# Altium schematic sheet Power.SchDoc
size A4; SheetNumber: 5; SheetTotal: 7
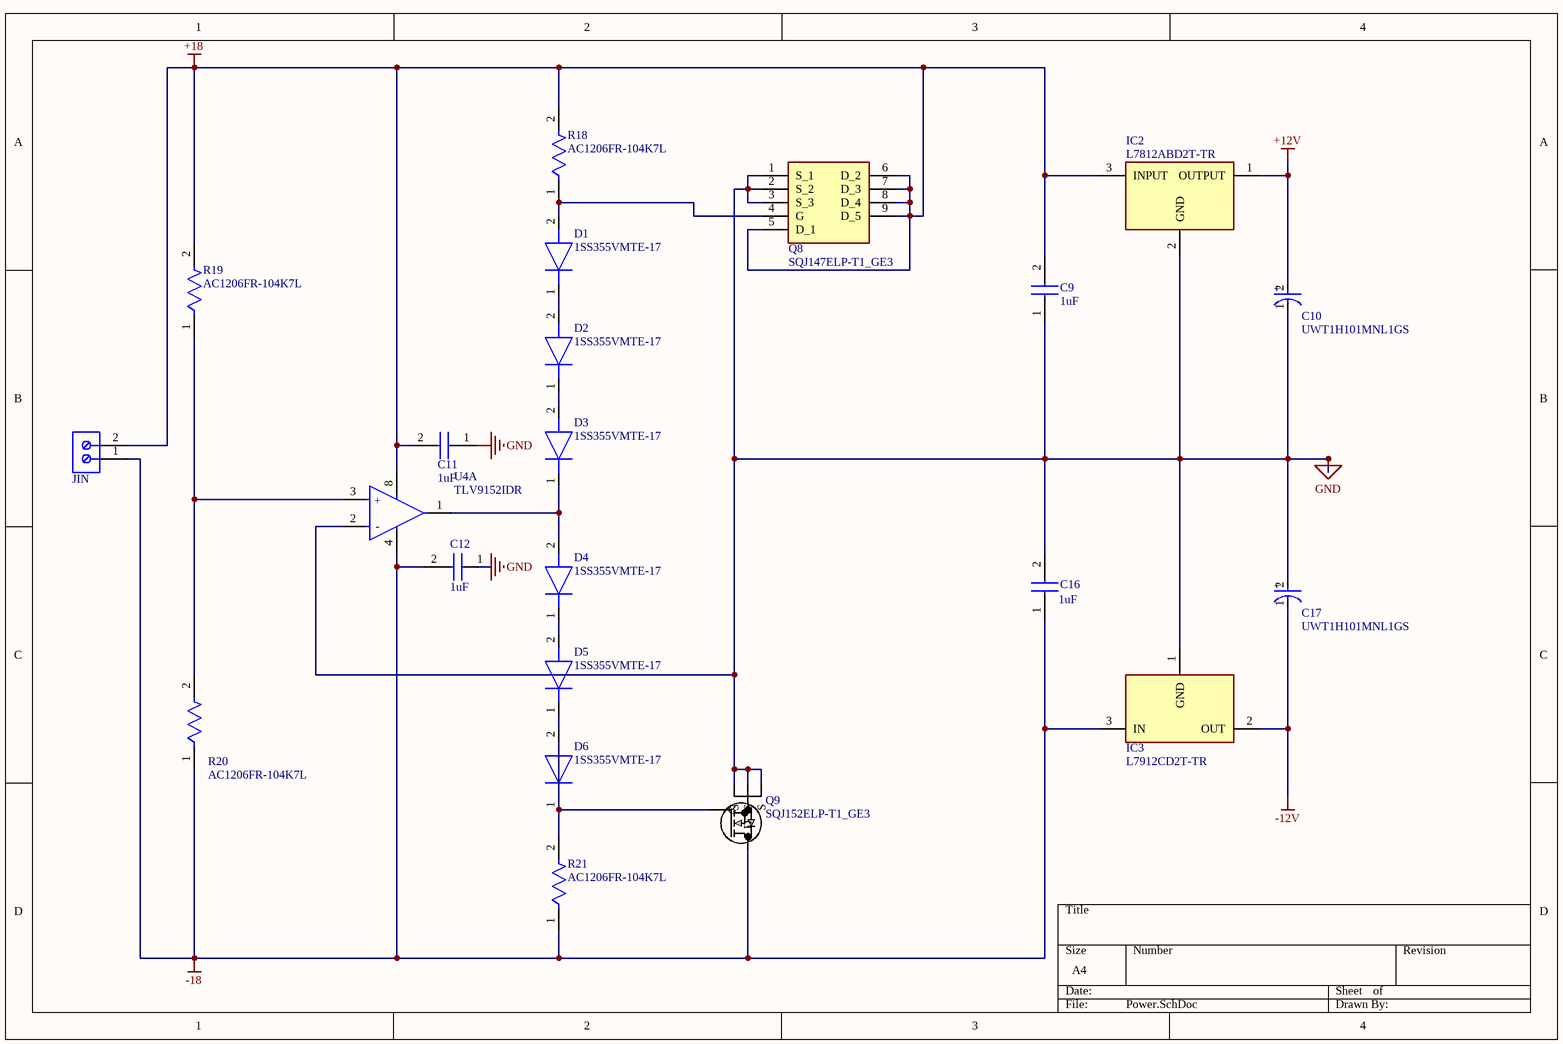
[diagram p0: Power.SchDoc]

## Parts
C9  1uF  [CAPC3216X178N]
C10  UWT1H101MNL1GS  [FP-UWT1H101MNL1GS-MFG]
C11  1uF  [CAPC3216X178N]
C12  1uF  [CAPC3216X178N]
C16  1uF  [CAPC3216X178N]
C17  UWT1H101MNL1GS  [FP-UWT1H101MNL1GS-MFG]
D1  1SS355VMTE-17  [UDZVTE1722B]
D2  1SS355VMTE-17  [UDZVTE1722B]
D3  1SS355VMTE-17  [UDZVTE1722B]
D4  1SS355VMTE-17  [UDZVTE1722B]
D5  1SS355VMTE-17  [UDZVTE1722B]
D6  1SS355VMTE-17  [UDZVTE1722B]
IC2  L7812ABD2T-TR  [L7812ABD2TTR]
IC3  L7912CD2T-TR  [L7905CD2TTR]
JIN  1714955  [PHOE-1714955_V]  (value not drawn)
Q8  SQJ147ELP-T1_GE3  [SQJ147ELPT1_GE3]
Q9  SQJ152ELP-T1_GE3  [DPAK5_ELP-T1_GE3_VIS]
R18  AC1206FR-104K7L  [FP-AC1206-MFG]
R19  AC1206FR-104K7L  [FP-AC1206-MFG]
R20  AC1206FR-104K7L  [FP-AC1206-MFG]
R21  AC1206FR-104K7L  [FP-AC1206-MFG]
U4  TLV9152IDR  [FP-D0008A-IPC_A]  (part A of 2)

## Nets
+12V: C10.2(A) IC2.1(OUTPUT)
+18: C9.2 C11.2 IC2.3(INPUT) JIN.2 Q8.5(D_1) Q8.6(D_2) Q8.7(D_3) Q8.8(D_4) Q8.9(D_5) R18.2 R19.2 U4.8(V+)
-12V: C17.1(C) IC3.2(OUT)
-18: C12.2 C16.1 IC3.3(IN) JIN.1 Q9.5(D) R20.1 R21.1 U4.4(V-)
GND: C9.1 C10.1(C) C11.1 C12.1 C16.2 C17.2(A) IC2.2(GND) IC3.1(GND) Q8.1(S_1) Q8.2(S_2) Q8.3(S_3) Q9.1(S) Q9.2(S) Q9.3(S) U4.2(IN1-)
NetD1_1: D1.1(K) D2.2(A)
NetD1_2: D1.2(A) Q8.4(G) R18.1
NetD2_1: D2.1(K) D3.2(A)
NetD3_1: D3.1(K) D4.2(A) U4.1(OUT1)
NetD4_1: D4.1(K) D5.2(A)
NetD5_1: D5.1(K) D6.2(A)
NetD6_1: D6.1(K) Q9.4(G) R21.2
NetR19_1: R19.1 R20.2 U4.3(IN1+)

## Notes on the sheet
- (in symbol CMP-2000-07373-2) +
- (in symbol CMP-04895-000148-1, part A) +; -

## Library data of the parts
C9 C11 C12 C16 = 12063C105MAT2A: Capacitor 12063C105MAT2A; Manufacturer_Name: AVX; Datasheet Link: https://spicat.kyocera-avx.com/product/mlcc/chartview/12063C105MAT2A/DataSheet/X7R; Height: 1.78mm; Manufacturer_Part_Number: 12063C105MAT2A; Mouser Part Number: 581-12063C105MAT2A; Mouser Price/Stock: https://www.mouser.com/Search/Refine.aspx?Keyword=581-12063C105MAT2A; Arrow Part Number: 12063C105MAT2A; Arrow Price/Stock: https://www.arrow.com/en/products/12063c105mat2a/avx
C10 C17 = CMP-2000-07373-2: CAP ALUM 100UF 20% 50V SMD; Leakage Current: 3uA; Ripple Current: 140mA; Life (Hours): 1000Hour; Dissipation Factor: 0.14%; Dielectric Material: Aluminium; Termination: SMD/SMT; Tolerance: 20%; Package Quantity: 500; Capacitance: 100uF; Height: 10mm; REACH SVHC: No SVHC; Case/Package: Radial; Series: WT; Diameter: 8mm; Voltage Rating: 50V; Construction: Cylindrical; Length: 10mm; Min Operating Temperature: -55°C; Max Operating Temperature: 105°C; Voltage Rating (DC): 50V; Packaging: Tape and Reel; Voltage: 50V; Mount: Surface Mount; Ripple Current (AC): 140mA; Radiation Hardening: No; Number of Pins: 2; Lead Free: Lead Free; Height - Seated (Max): 0.413inch; RoHS Compliant: Yes
D1-D6 = 1SS355VMTE-17: Diode; Manufacturer_Name: ROHM Semiconductor; Datasheet Link: https://datasheet.datasheetarchive.com/originals/distributors/Datasheets_SAMA/726503b2436a9ce4bc644e4966373f1b.pdf; Height: 0mm; Manufacturer_Part_Number: 1SS355VMTE-17; Mouser Part Number: 755-1SS355VMTE-17; Mouser Price/Stock: https://www.mouser.co.uk/ProductDetail/ROHM-Semiconductor/1SS355VMTE-17?qs=IsRgwgmxh693733hapxfjA%3D%3D
IC2 = L7812ABD2T-TR: Integrated Circuit; Manufacturer_Name: STMicroelectronics; Datasheet Link: https://componentsearchengine.com/Datasheets/1/L7812ABD2T-TR.pdf; Height: 4.7mm; Manufacturer_Part_Number: L7812ABD2T-TR; Mouser Part Number: 511-L7812ABD2T-TR; Mouser Price/Stock: https://www.mouser.co.uk/ProductDetail/STMicroelectronics/L7812ABD2T-TR?qs=llfGyK1OjE3hWetai%252BQcKg%3D%3D; Arrow Part Number: L7812ABD2T-TR; Arrow Price/Stock: https://www.arrow.com/en/products/l7812abd2t-tr/stmicroelectronics?region=europe
IC3 = L7912CD2T-TR: Integrated Circuit; Manufacturer_Name: STMicroelectronics; Datasheet Link: http://www.st.com/web/en/resource/technical/document/datasheet/CD00000450.pdf; Height: 4.6mm; Manufacturer_Part_Number: L7912CD2T-TR; Mouser Part Number: 511-L7912CD2T-TR; Mouser Price/Stock: https://www.mouser.co.uk/ProductDetail/STMicroelectronics/L7912CD2T-TR?qs=3sbPgdekz232r2AmOaAD%252Bg%3D%3D; Arrow Part Number: L7912CD2T-TR; Arrow Price/Stock: https://www.arrow.com/en/products/l7912cd2t-tr/stmicroelectronics?region=nac
JIN = CMP-2000-05797-1: PC Terminal Block, Pitch 6.35 mm, 1 x 2 Position, Height 21.5 mm, Tail Lenght 5.1 mm, RoHS, Bulk; Manufacturer: Phoenix Contact; Package Description: PC Terminal Block, Pitch 6.35 mm, 1 x 2 Position, Height 21.5 mm, Tail Lenght 5.1 mm; Datasheet URL: http://media.digikey.com/pdf/Data%20Sheets/Phoenix%20Contact%20PDFs/1714955.pdf; Package Reference: 1714955; Manufacturer URL: http://www.phoenixcontact.com/; Datasheet Version: 02/2010; Mounting Technology: ThroughHole
Q8 = SQJ147ELP-T1_GE3: MOSFET (N-Channel); Manufacturer_Name: Vishay; Datasheet Link: https://www.vishay.com/docs/77857/sqj147elp.pdf; Height: 1.227mm; Manufacturer_Part_Number: SQJ147ELP-T1_GE3; Mouser Part Number: 78-SQJ147ELP-T1_GE3; Mouser Price/Stock: https://www.mouser.co.uk/ProductDetail/Vishay-Siliconix/SQJ147ELP-T1_GE3?qs=81r%252BiQLm7BRdyhBg3DuaKw%3D%3D; Arrow Part Number: SQJ147ELP-T1_GE3; Arrow Price/Stock: https://www.arrow.com/en/products/sqj147elp-t1-ge3/vishay?region=nac
Q9 = SQJ152ELP-T1_GE3: No Description Available; Mfr_Name: Vishay; Type: DEV; Copyright: Copyright (C) 2023 Ultra Librarian. All rights reserved.; Manufacturer_Part_Number: SQJ152ELP-T1_GE3; RefDes: RefDes
R18-R21 = CMP-03412-035718-1: AC1206 4.7KΩ 0.25W 1.00%; Manufacturer: Yageo; Tolerance: 0.01; Automotive Grade: Grade 0; Voltage Rating: 200V; Lead Free: Yes; Composition: Thick Film; Category: Res; Device Class L2: Resistors; Device Class L1: Passive Components; Ipc Land Pattern Name: RESC310160X55; ComponentLink2URL: http://www.yageo.com/NewPortal/yageodocoutput?fileName=/pdf/R-Chip/PYu-AC_51_RoHS_L_6.pdf; Octopart: https://octopart.com/ac1206fr-104k7l-yageo-84718857; Package: AC1206; ComponentLink2Description: Datasheet; RoHS: TRUE; Resistance: 4.7KΩ; Value: 4.7KΩ; Temperature Range High: +155°C; Device Class L3: Chip SMD Resistors; Footprint Url: http://www.yageo.com/exep/pages/download/literatures/PYu-R_Mount_10.pdf; Temperature Range Low: -55°C; Manufacturer Part Number: AC1206FR-104K7L; Automotive: Yes; Height: 0.65mm; Series: AC; Power Rating: 0.25W; Temperature: -55°C to +155°C
U4 = CMP-04895-000148-1: IC OPAMP GP 2 CIRCUIT 8SOIC